# Altium schematic sheet 000_MCUs.SchDoc
size A4; SheetNumber: 2; SheetTotal: 4
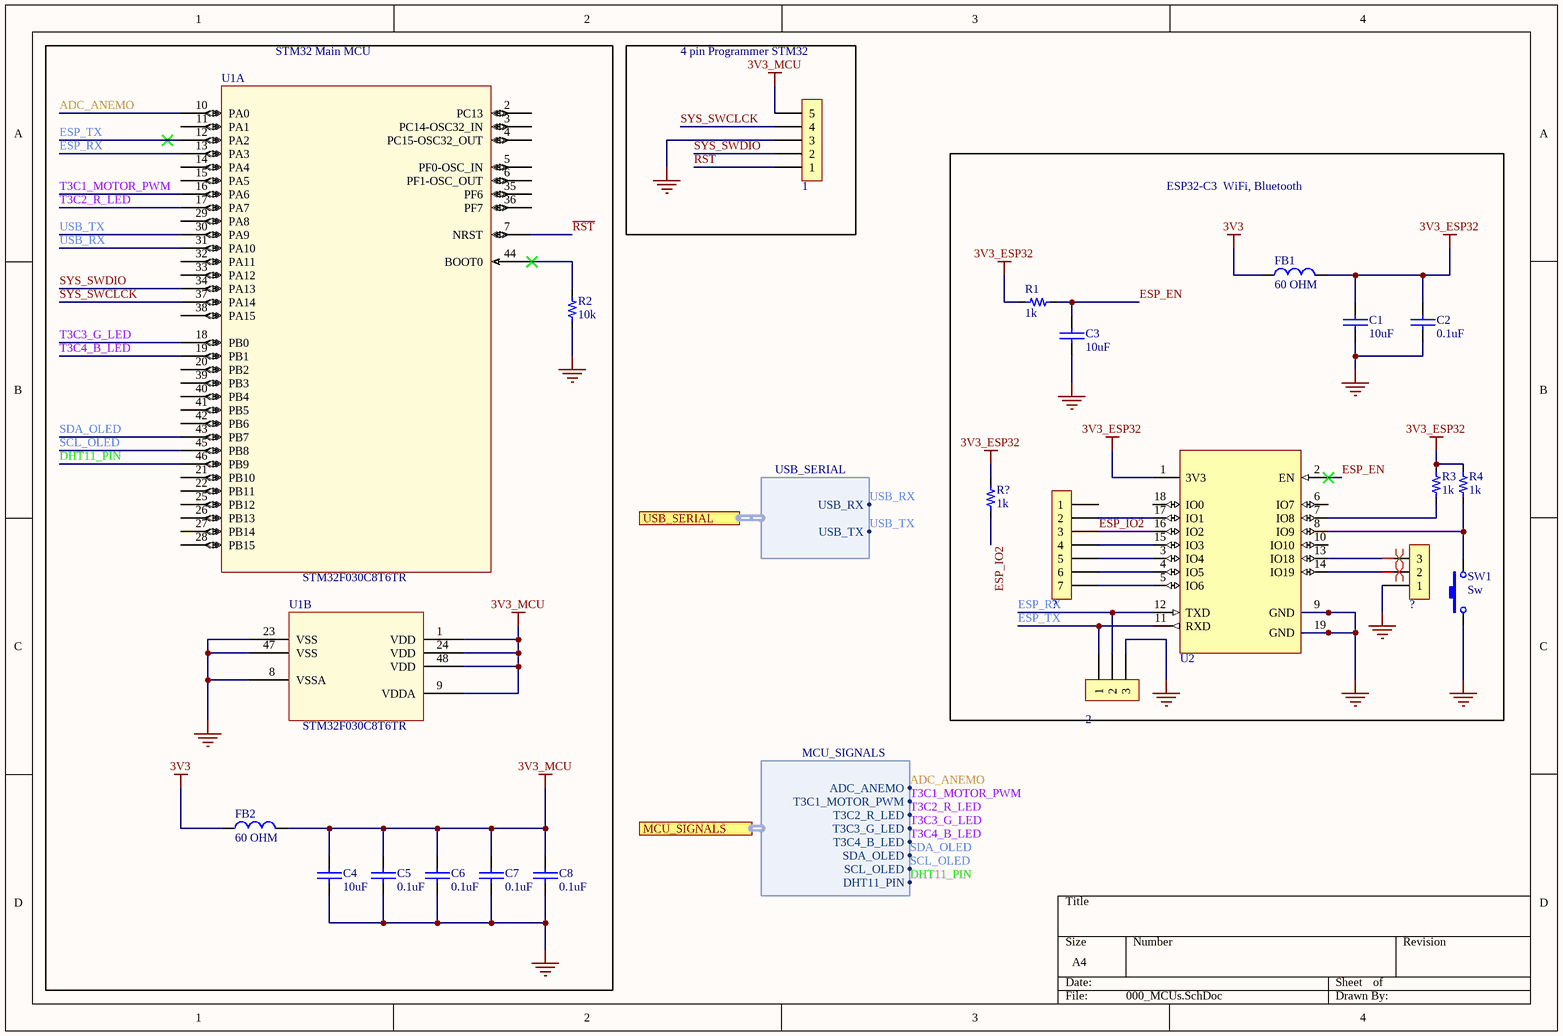
[diagram p0: 000_MCUs.SchDoc]

## Parts
(Parts that share a designator on the sheet are numbered #1, #2 ... from top to bottom, then left to right.)
1  5x1  [H_5x1_TH_100mil]  (value not drawn)  (no BOM)
2  3x1  [H_3X1_TH_100mil]  (value not drawn)  (no BOM)
?#1  7x1  [H_7x1_TH_100mil]  (value not drawn)  (no BOM)
?#2  3x1  [H_3X1_TH_100mil]  (value not drawn)  (no BOM)
C1  value 10uF  [0805_cap]  (hidden comment: 10uF 25V)
C2  value 0.1uF  [0603_cap]  (hidden comment: 0.1uF 50V)
C3  value 10uF  [0805_cap]  (hidden comment: 10uF 25V)
C4  value 10uF  [0805_cap]  (hidden comment: 10uF 25V)
C5  value 0.1uF  [0603_cap]  (hidden comment: 0.1uF 50V)
C6  value 0.1uF  [0603_cap]  (hidden comment: 0.1uF 50V)
C7  value 0.1uF  [0603_cap]  (hidden comment: 0.1uF 50V)
C8  value 0.1uF  [0603_cap]  (hidden comment: 0.1uF 50V)
FB1  value 60 OHM  [0603_fb]  (hidden comment: 60OHM 2A)
FB2  value 60 OHM  [0603_fb]  (hidden comment: 60OHM 2A)
R1  value 1k  [0603_res]  (hidden comment: 1k 1/10W)
R2  value 10k  [0603_res]  (hidden comment: 10k 1/10W)
R3  value 1k  [0603_res]  (hidden comment: 1k 1/10W)
R4  value 1k  [0603_res]  (hidden comment: 1k 1/10W)
R?  value 1k  [0603_res]  (hidden comment: 1k 1/10W)
SW1  Sw  [Sw_PUSH_4.5x4.5x5mm]
U1  STM32F030C8T6TR  [LQFP48_7x7mm]  (parts A,B of 2)
U2  ESP32-C3-WROOM-02-N4  [ESP32-C3-WROOM-02-N4]  (value not drawn)

## Blocks framed on the sheet
STM32 Main MCU: C4-C8 FB2 R2 U1
4 pin Programmer STM32: 1
ESP32-C3  WiFi, Bluetooth: 2 ?#1 ?#2 C1-C3 FB1 R1 R3 R4 R? SW1 U2

## Ports
MCU_SIGNALS (harness MCU_SIGNALS, see Main[2A], 100_Motor_Mosfet_RGB[1B]), USB_SERIAL (harness USB_SERIAL, see Main[2B], 200_DCDC_5V-3V3_USBC[3B])

## Harnesses
MCU_SIGNALS: ADC_ANEMO, T3C1_MOTOR_PWM, T3C2_R_LED, T3C3_G_LED, T3C4_B_LED, SDA_OLED, SCL_OLED, DHT11_PIN
USB_SERIAL: USB_RX, USB_TX

## Nets
3V3: FB1.1 FB2.1
3V3_ESP32: C1.1 C2.1 FB1.2 R1.2 R3.2 R4.2 R?.2 U2.1(3V3)
3V3_MCU: 1.5 C4.1 C5.1 C6.1 C7.1 C8.1 FB2.2 U1.1(VDD) U1.9(VDDA) U1.24(VDD) U1.48(VDD)
GND: 1.3 2.3 ?#2.1 C1.2 C2.2 C3.2 C4.2 C5.2 C6.2 C7.2 C8.2 R2.1 SW1.1 U1.8(VSSA) U1.23(VSS) U1.47(VSS) U2.9(GND) U2.19(GND)
ADC_ANEMO: U1.10(PA0) ; port MCU_SIGNALS.ADC_ANEMO
DHT11_PIN: U1.46(PB9) ; port MCU_SIGNALS.DHT11_PIN
ESP_EN: C3.1 R1.1 U2.2(EN)
ESP_IO2: ?#1.3 R?.1 U2.16(IO2)
ESP_RX: 2.2 U1.13(PA3) U2.12(TXD)
ESP_TX: 2.1 U1.12(PA2) U2.11(RXD)
~{RST}: 1.1 U1.7(NRST)
SCL_OLED: U1.45(PB8) ; port MCU_SIGNALS.SCL_OLED
SDA_OLED: U1.43(PB7) ; port MCU_SIGNALS.SDA_OLED
SYS_SWCLCK: 1.4 U1.37(PA14)
SYS_SWDIO: 1.2 U1.34(PA13)
T3C1_MOTOR_PWM: U1.16(PA6) ; port MCU_SIGNALS.T3C1_MOTOR_PWM
T3C2_R_LED: U1.17(PA7) ; port MCU_SIGNALS.T3C2_R_LED
T3C3_G_LED: U1.18(PB0) ; port MCU_SIGNALS.T3C3_G_LED
T3C4_B_LED: U1.19(PB1) ; port MCU_SIGNALS.T3C4_B_LED
USB_RX: U1.31(PA10) ; port USB_SERIAL.USB_RX
USB_TX: U1.30(PA9) ; port USB_SERIAL.USB_TX
Net?#1_2: ?#1.2 U2.17(IO1)
Net?#1_4: ?#1.4 U2.15(IO3)
Net?#1_5: ?#1.5 U2.3(IO4)
Net?#1_6: ?#1.6 U2.4(IO5)
Net?#1_7: ?#1.7 U2.5(IO6)
Net?#2_2: ?#2.2 U2.14(IO19)
Net?#2_3: ?#2.3 U2.13(IO18)
NetR2_2: R2.2 U1.44(BOOT0)
NetR3_1: R3.1 U2.7(IO8)
NetR4_1: R4.1 SW1.2 U2.8(IO9)

Not connected (* = marked no-connect by the designer): ?#1 1; U1 2(PC13) 3(PC14-OSC32_IN) 4(PC15-OSC32_OUT) 5(PF0-OSC_IN) 6(PF1-OSC_OUT) 11(PA1) 14(PA4) 15(PA5) 20(PB2) 21(PB10) 22(PB11) 25(PB12) 26(PB13) 27(PB14) 28(PB15) 29(PA8) 32(PA11) 33(PA12) 35(PF6) 36(PF7) 38(PA15) 39(PB3) 40(PB4) 41(PB5) 42(PB6); U2 6(IO7) 10(IO10) 18(IO0)

## Layout directives
differential pair; differential pair class USB_2.0: Net?#2_2, Net?#2_3

## Library data of the parts
1 = H_Male_5x1_TH_100mil: ComponentLink1Description: LCSC
2 ?#2 = H_Male_3x1_TH_100mil: ComponentLink1Description: LCSC
?#1 = H_Male_7x1_TH_100mil: ComponentLink1Description: LCSC
C1 C3 C4 = Cap_10uF_0805_25V_: 25V 10uF X5R ±10% 0805 Multilayer Ceramic Capacitors MLCC - SMD/SMT ROHS; Manufacturer: Samsung Electro-Mechanics; Manufacturer Part Number: CL21A106KAYNNNE; Supplier 1: LCSC; Supplier Part Number 1: C15850; ComponentLink1Description: LCSC; ComponentLink1URL: https://lcsc.com/product-detail/Multilayer-Ceramic-Capacitors-MLCC-SMD-SMT_Samsung-Electro-Mechanics-CL21A106KAYNNNE_C15850.html
C2 C5-C8 = Cap_0.1uF_0603_50V: 50V 100nF Y5V -20%~+80% 0603 Multilayer Ceramic Capacitors MLCC - SMD/SMT ROHS; Manufacturer: Walsin Tech Corp; Manufacturer Part Number: 0603F104Z500CT; Supplier 1: LCSC; Supplier Part Number 1: C83060; ComponentLink1Description: LCSC; ComponentLink1URL: https://www.lcsc.com/product-detail/Multilayer-Ceramic-Capacitors-MLCC-SMD-SMT_Walsin-Tech-Corp-0603F104Z500CT_C83060.html
FB1 FB2 = FB_60_0603_2A: 2A 1 100mΩ 60Ω@100MHz ±25% 0603 Ferrite Beads ROHS; Manufacturer: TAI-TECH; Manufacturer Part Number: HCB1608KF-600T20; ComponentLink1Description: LCSC; ComponentLink1URL: https://www.lcsc.com/product-detail/Ferrite-Beads_TAI-TECH-HCB1608KF-600T20_C369516.html; Supplier 1: LCSC; Supplier Part Number 1: C369516
R1 R3 R4 R? = Res_1k_0603_1/10W: RES SMD 1k OHM 5% 1/10W 0603; Manufacturer: FOJAN; Manufacturer Part Number: FRC0603J102 TS; ComponentLink1URL: https://www.lcsc.com/product-detail/Chip-Resistor-Surface-Mount_FOJAN-FRC0603J102-TS_C2907113.html; Supplier 1: LCSC; Supplier Part Number 1: C2907113; ComponentLink1Description: LCSC
R2 = Res_10k_0603_1/10W: RES SMD 10k OHM 5% 1/10W 0603; Manufacturer: FOJAN; Manufacturer Part Number: FRC0603J103TS; ComponentLink1URL: https://www.lcsc.com/product-detail/Chip-Resistor-Surface-Mount_FOJAN-FRC0603J103TS_C2930027.html; Supplier 1: LCSC; Supplier Part Number 1: C2930027; ComponentLink1Description: LCSC
SW1 = Sw_PUSH_4.5x4.5x5.0xmm: SWITCH TACTILE SPST-NO 0.05A 12V; Manufacturer: BZCN; Manufacturer Part Number: TSC015A05026A; Supplier 1: LCSC; Supplier Part Number 1: C2888509; Last modified by: N-A.Potosi; Last modified date: 20190222; ComponentLink1Description: LCSC; ComponentLink1URL: https://www.lcsc.com/product-detail/Tactile-Switches_BZCN-TSC015A05026A_C2888509.html
U1 = IC_STM32F030C8T6TR_LQFP48_7x7MM: IC MCU 32BIT 64KB FLASH 48LQFP; Manufacturer: STMicroelectronics; Manufacturer part number: STM32F030C8T6TR; Supplier 1: LCSC; Supplier Part Number 1: C23922; ComponentLink1Description: LCSC; ComponentLink1URL: https://www.lcsc.com/product-detail/ST-Microelectronics_STMicroelectronics-STM32F030C8T6_C23922.html
U2 = MCU_ESP32-C3-WROOM-02-N4: RF TXRX MOD BT WIFI PCB TH SMD; Manufacturer: Espressif Systems; Manufacturer Part Number: ESP32-C3-WROOM-02-N4; Supplier 1: LCSC; Supplier Part Number 1: C2934560; ComponentLink1Description: LCSC; ComponentLink1URL: https://lcsc.com/product-detail/WiFi-Modules_Espressif-Systems-ESP32-C3-WROOM-02-N4_C2934560.html